# Altium schematic sheet L298N.SchDoc
size A4; SheetNumber: 3; SheetTotal: 4
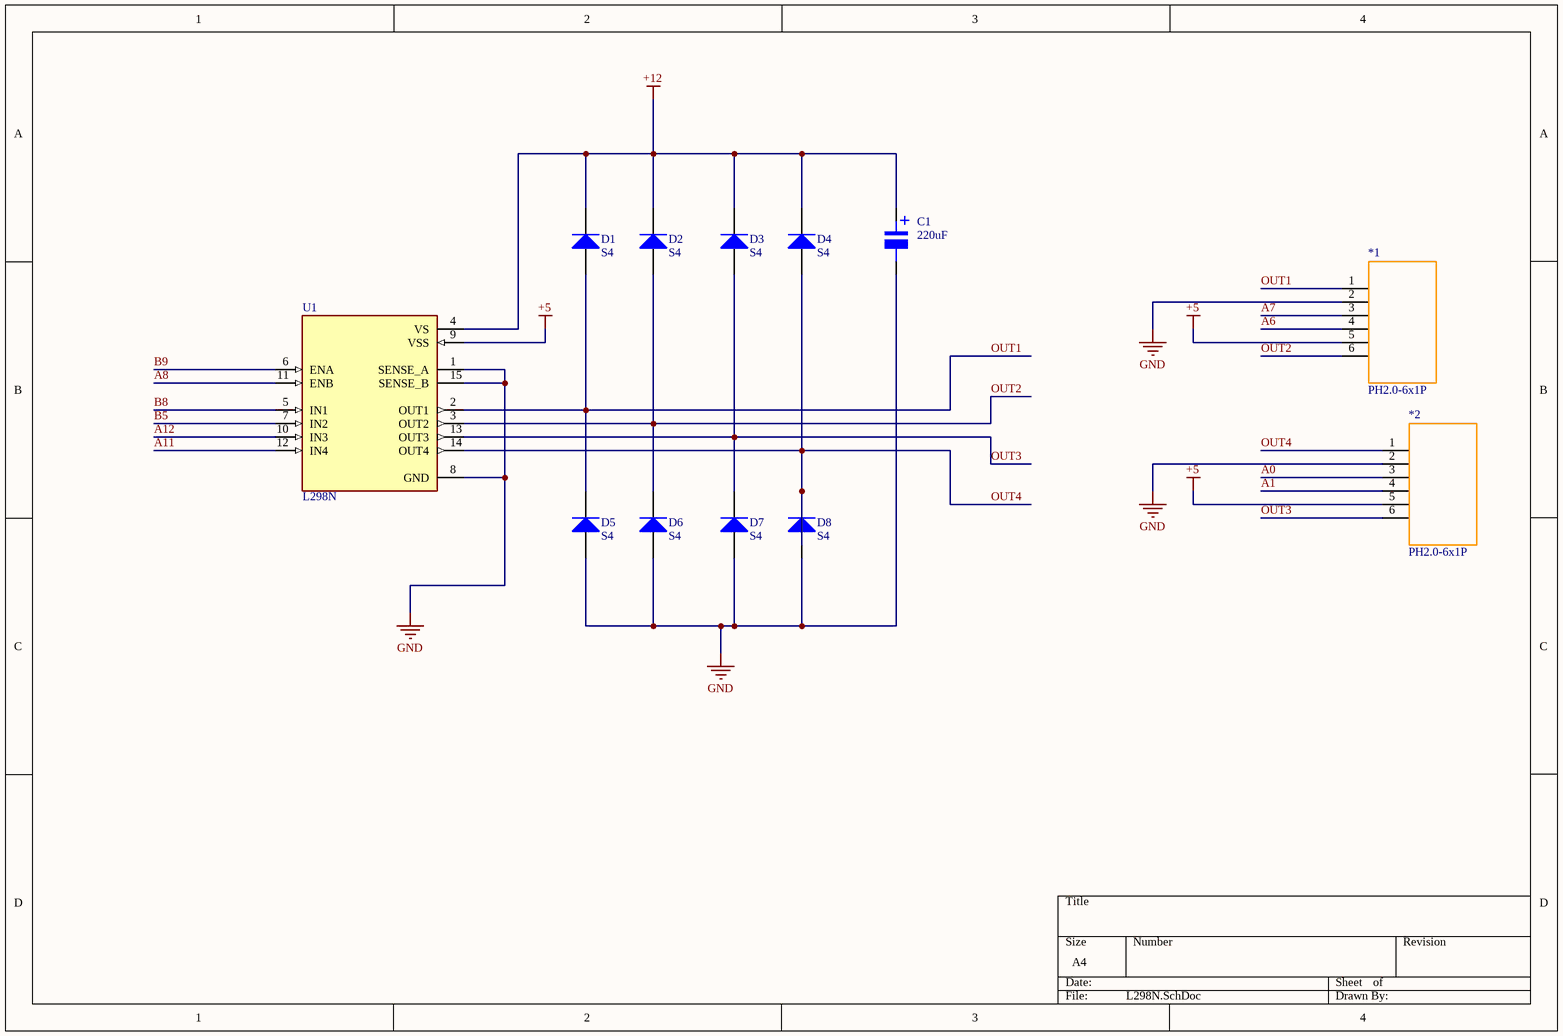
[diagram p0: L298N.SchDoc]

## Parts
*1  PH2.0-6x1P  [PH2.0-6P]
*2  PH2.0-6x1P  [PH2.0-6P]
C1  220uF  [tu nhom 8 (f)]
D1  S4  [DIODE SOD-123]
D2  S4  [DIODE SOD-123]
D3  S4  [DIODE SOD-123]
D4  S4  [DIODE SOD-123]
D5  S4  [DIODE SOD-123]
D6  S4  [DIODE SOD-123]
D7  S4  [DIODE SOD-123]
D8  S4  [DIODE SOD-123]
U1  L298N  [L298N]

## Nets
+5: *1.5 *2.5 U1.9(VSS)
+12: C1.1 D1.2(K) D2.2(K) D3.2(K) D4.2(K) U1.4(VS)
GND: *1.2 *2.2 C1.2 D5.1(A) D6.1(A) D7.1(A) D8.1(A) U1.1(SENSE_A) U1.8(GND) U1.15(SENSE_B)
A0: *2.3
A1: *2.4
A6: *1.4
A7: *1.3
A8: U1.11(ENB)
A11: U1.12(IN4)
A12: U1.10(IN3)
B5: U1.7(IN2)
B8: U1.5(IN1)
B9: U1.6(ENA)
OUT1: *1.1 D1.1(A) D5.2(K) U1.2(OUT1)
OUT2: *1.6 D2.1(A) D6.2(K) U1.3(OUT2)
OUT3: *2.6 D3.1(A) D7.2(K) U1.13(OUT3)
OUT4: *2.1 D4.1(A) D8.2(K) U1.14(OUT4)

## Notes on the sheet
- (in symbol Tu Nhom 220uF 25V) +

## Library data of the parts
C1 = Tu Nhom 220uF 25V: Dán; Don_Vi: Con; So_Chan: 2; Ten_Linh_Kien: Tụ Nhôm 220uF 25V; Ma_Hang: MH002221; Chung_Loai: Dán; Kieu_Chan: *
D1-D8 = Diode S4: Dán; Ten_Linh_Kien: Diode S4 SOD123 ( 1N5819 SOD123); Ma_Hang: MH005519; Don_Vi: Con; Ghi_Chu: *; Chung_Loai: Dán; Kieu_Chan: *
U1 = L298N: Half Bridge _4_ Driver DC Motors, Relays, Solenoids, Stepper Motors Bipolar 15-Multiwatt; MF: STMicroelectronics; MP: L298N; Package: Multiwatt-15 STMicroelectronics; Price: None; Availability: Unavailable; Value: *; SnapEDA_Link: https://www.snapeda.com/parts/L298N/STMicroelectronics/view-part/294022/?ref=snap